# EAGLE design brick_i2c_humidity_mini (EAGLE 7.4.0)
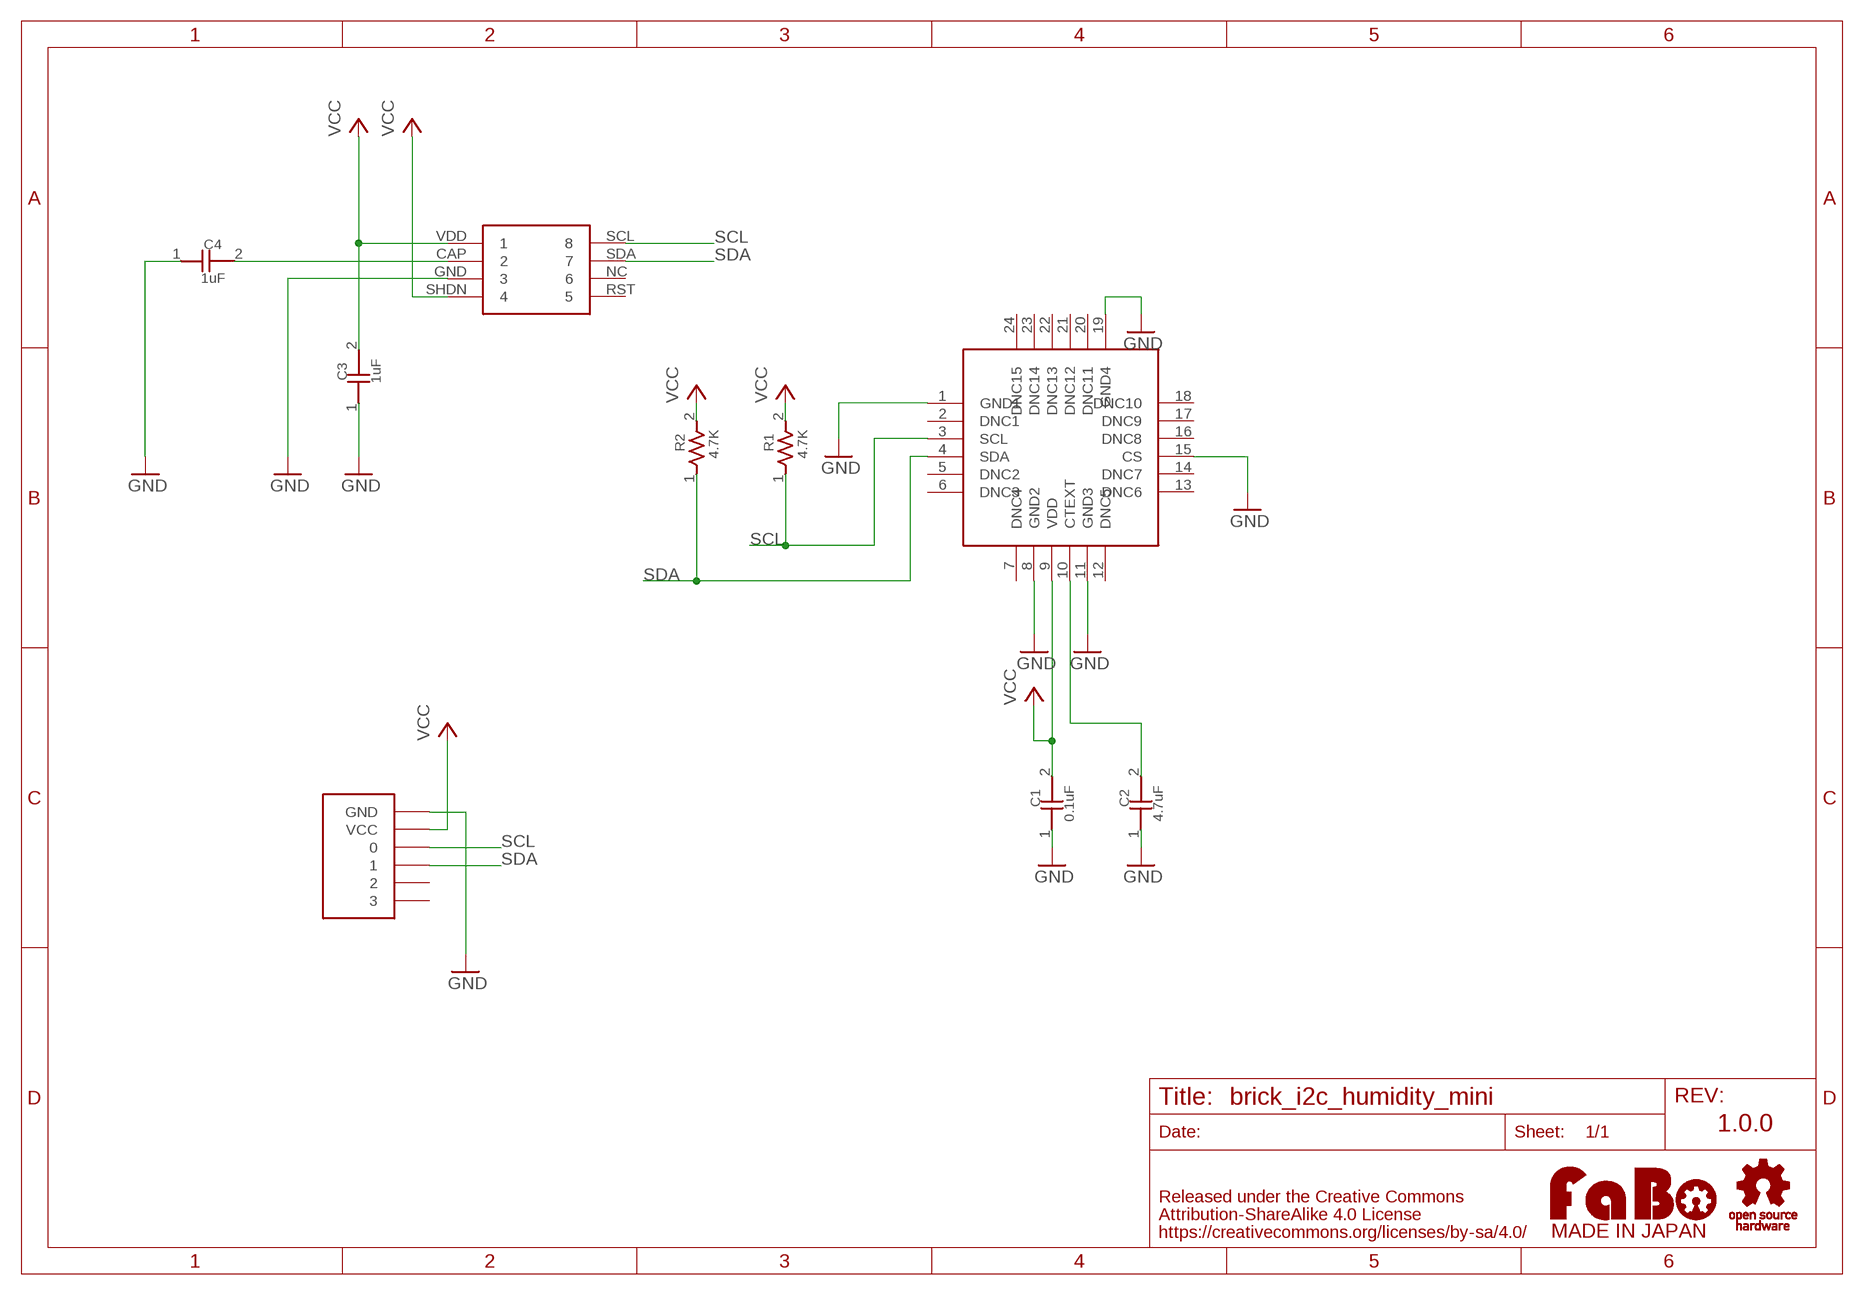
[diagram p0: schematic, sheet 1]

## Parts
C1  0.1uF  CAPACITOR0603  [0603]
C2  4.7uF  CAPACITOR0603  [0603]
C3  1uF  CAPACITOR0603  [0603]
C4  1uF  CAPACITOR0603  [0603]
R1  4.7K  RESISTOR0603  [0603]
R2  4.7K  RESISTOR0603  [0603]
SI1  SILICONLAB-SI7005  [SILICONLAB-SI7005]
U$2  LOGO_OSHW-S_BOTTOM  [LOGO_OSHW_S_BOTTOM]
U$3  I2C-MPL115A2  [I2C-MLP115A2]
U$4  LOGO_FABO-S_BOTTOM  [LOGO_FABO_S_BOTTOM]
U$5  FABO-NANO  [FABO-NANO]

## Nets
GND: C1.1 C2.1 C3.1 C4.1 SI1.1(GND1) SI1.8(GND2) SI1.11(GND3) SI1.15(CS) SI1.19(GND4) U$3.GND U$5.GND
N$1: C2.2 SI1.10(CTEXT)
N$2: C4.2 U$3.CAP
SCL: R1.1 SI1.3(SCL) U$3.SCL U$5.0
SDA: R2.1 SI1.4(SDA) U$3.SDA U$5.1
VCC: C1.2 C3.2 R1.2 R2.2 SI1.9(VDD) U$3.SHDN U$3.VDD U$5.VCC
Unconnected: SI1.2(DNC1) SI1.5(DNC2) SI1.6(DNC3) SI1.7(DNC4) SI1.12(DNC5) SI1.13(DNC6) SI1.14(DNC7) SI1.16(DNC8) SI1.17(DNC9) SI1.18(DNC10) SI1.20(DNC11) SI1.21(DNC12) SI1.22(DNC13) SI1.23(DNC14) SI1.24(DNC15) U$3.NC U$3.RST U$5.2 U$5.3

## Notes on the sheet
- 1.0.0

## Library data of the parts
C1-C4 = GClue-Capacitor:CAPACITOR
R1 R2 = GClue-Resistors:RESISTOR
SI1 = gclueSensor:SILICONLAB-SI7005
U$2 = FaBo-etc:LOGO_OSHW
U$3 = gclue:I2C-MPL115A2
U$4 = FaBo-etc:LOGO_FABO
U$5 = FaBo-Template:FABO-NANO

## Board
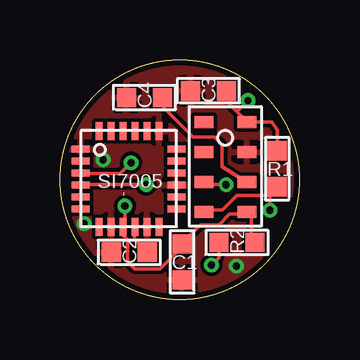
[diagram p1: board, top side]
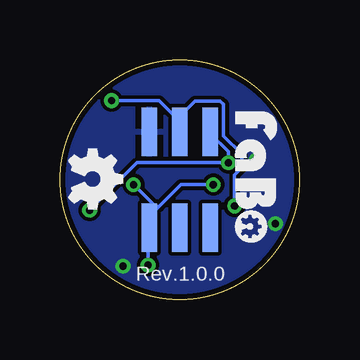
[diagram p2: board, bottom side, seen from below]

Size 10 x 10 mm. Coordinates in mm from the lower left corner, seen from the top.
Copper layers (1*16): Top 0.035mm / dielectric 1.5mm / Bottom 0.035mm
Design rules "Elecrow_2-layer_eagle_rule": minimum track width 6mil, minimum drill 12mil, track to track 6mil, track to pad 6mil, pad to pad 6mil, via to via 6mil, smd to smd 0mil, copper to edge 10mil, drill to drill 10mil, minimum pad ring 10mil, minimum via ring 6mil, stop-mask expansion 2mil, vias tented up to drill 100mil, thermal gap 10mil

### Footprints (pad centres in the part's own frame; a part is rotated, then mirrored left to right if it is on the bottom)
0603 = smd 0.8 x 0.8: 1 -0.75,0; 2 0.75,0
SILICONLAB-SI7005 = smd 0.75 x 0.3: 1 -2.01,1.23; 2 -2.01,0.73; 3 -2.01,0.23; 4 -2.01,-0.27; 5 -2.01,-0.77; 6 -2.01,-1.27; 13 1.99,-1.27; 14 1.99,-0.77; 15 1.99,-0.27; 16 1.99,0.23; 17 1.99,0.73; 18 1.99,1.23 | smd 0.3 x 0.75: 7 -1.23,-2.01; 8 -0.73,-2.01; 9 -0.23,-2.01; 10 0.27,-2.01; 11 0.77,-2.01; 12 1.27,-2.01; 19 1.27,1.99; 20 0.77,1.99; 21 0.27,1.99; 22 -0.23,1.99; 23 -0.73,1.99; 24 -1.23,1.99
I2C-MLP115A2 = smd 0.8 x 0.5: CAP -0.9,0.65; GND -0.9,-0.6; NC 0.9,-0.6; RST 0.9,-1.85; SCL 0.9,1.9; SDA 0.9,0.65; SHDN -0.9,-1.85; VDD -0.9,1.9
FABO-NANO = smd 0.635 x 2.032 bottom: 0 -1.27,2; 1 1.27,-2; 2 0,-2; 3 -1.27,-2; GND 1.27,2; VCC 0,2

### Placement (x,y rotation side)
C1  5.1,1.57 90 top
C2  2.89,1.98 0 top
C3  6.19,8.71 0 top
C4  3.53,8.43 0 top
R1  9.06,5.46 90 top
R2  7.39,2.38 0 top
SI1  2.87,5.05 0 top
U$2  8.63,5.03 90 top
U$3  6.91,5.56 180 top
U$4  2.69,5.05 90 top
U$5  5,5 0 top

### Tracks (layer width: path | path; a pad name or v marks a point on that pad's centre or on a via)
GND  (via drill 0.3)
  other vias: 7.36,1.39 1.8,5.84 1.01,3.17
  pour Bottom: -1.35,-1.35 11.35,-1.35 11.35,11.35 -1.35,11.35
  pour Top: -1.35,-1.35 11.35,-1.35 11.35,11.35 -1.35,11.35
N$1
  Top 0.152: SI1.10 3.12,2.97 3.12,2.51 3.58,2.05 C2.2
N$2
  Top 0.152: 7.51,5.08 6.75,5.56 6.75,6.47 6.45,6.78 5.56,6.78 4.34,8 4.34,8.3 C4.2 | 7.56,5 7.51,5.08 | 7.51,5.08 U$3.CAP
SCL  (via drill 0.3)
  Top 0.152: 8.76,4.34 7.39,4.34 6.78,3.73 6.02,3.73 U$3.SCL | 8.76,4.34 9.06,4.64 R1.1 8.76,4.34 | v2.97,5.71 2.51,5.25 0.99,5.25 SI1.3 | v8.76,3.73 8.76,4.34
  Bottom 0.152: U$5.0 3.73,6.93 2.97,6.17 v2.97,5.71 6.78,5.71 v8.76,3.73
SDA  (via drill 0.3)
  Top 0.152: v3.6,4.8 0.99,4.8 SI1.4 | v6.32,1.44 6.63,1.75 6.63,2.36 R2.1 | v6.93,4.8 6.02,4.8 U$3.SDA
  Bottom 0.152: v3.6,4.8 4.95,4.8 5.86,3.88 | 5.86,3.88 6.17,3.58 6.17,3.12 U$5.1 6.32,2.97 v6.32,1.44 | v6.93,4.8 6.02,3.88 5.86,3.88
VCC  (via drill 0.3)
  Top 0.152: R2.2 8,2.51 8,3.42 7.84,3.58 U$3.VDD 7.69,3.58 7.08,3.58 6.63,3.12 5.86,3.12 5.1,2.36 C1.2 5.1,2.21 4.19,1.29 3.12,1.29 2.82,1.6 2.82,2.51 2.66,2.66 2.66,2.97 SI1.9 2.71,3.15 v2.71,3.91 | 7.39,7.84 7.69,7.54 U$3.SHDN 8.83,7.41 9.06,7.08 R1.2 | 7.39,7.84 7.08,8.15 7.08,8.61 C3.2 | 7.39,7.84 v7.84,8.3
  Bottom 0.152: 5.1,7.54 5.1,7.08 U$5.VCC 5.1,7.54 | 5.1,7.54 5.86,8.3 v7.84,8.3 | v2.71,3.91 2.71,5.2 2.41,5.51 2.41,6.07 3.17,6.83 3.17,8.15 3.32,8.28 4.37,8.28 5.1,7.54

### Text on the board
bPlace: Rev.1.0.0